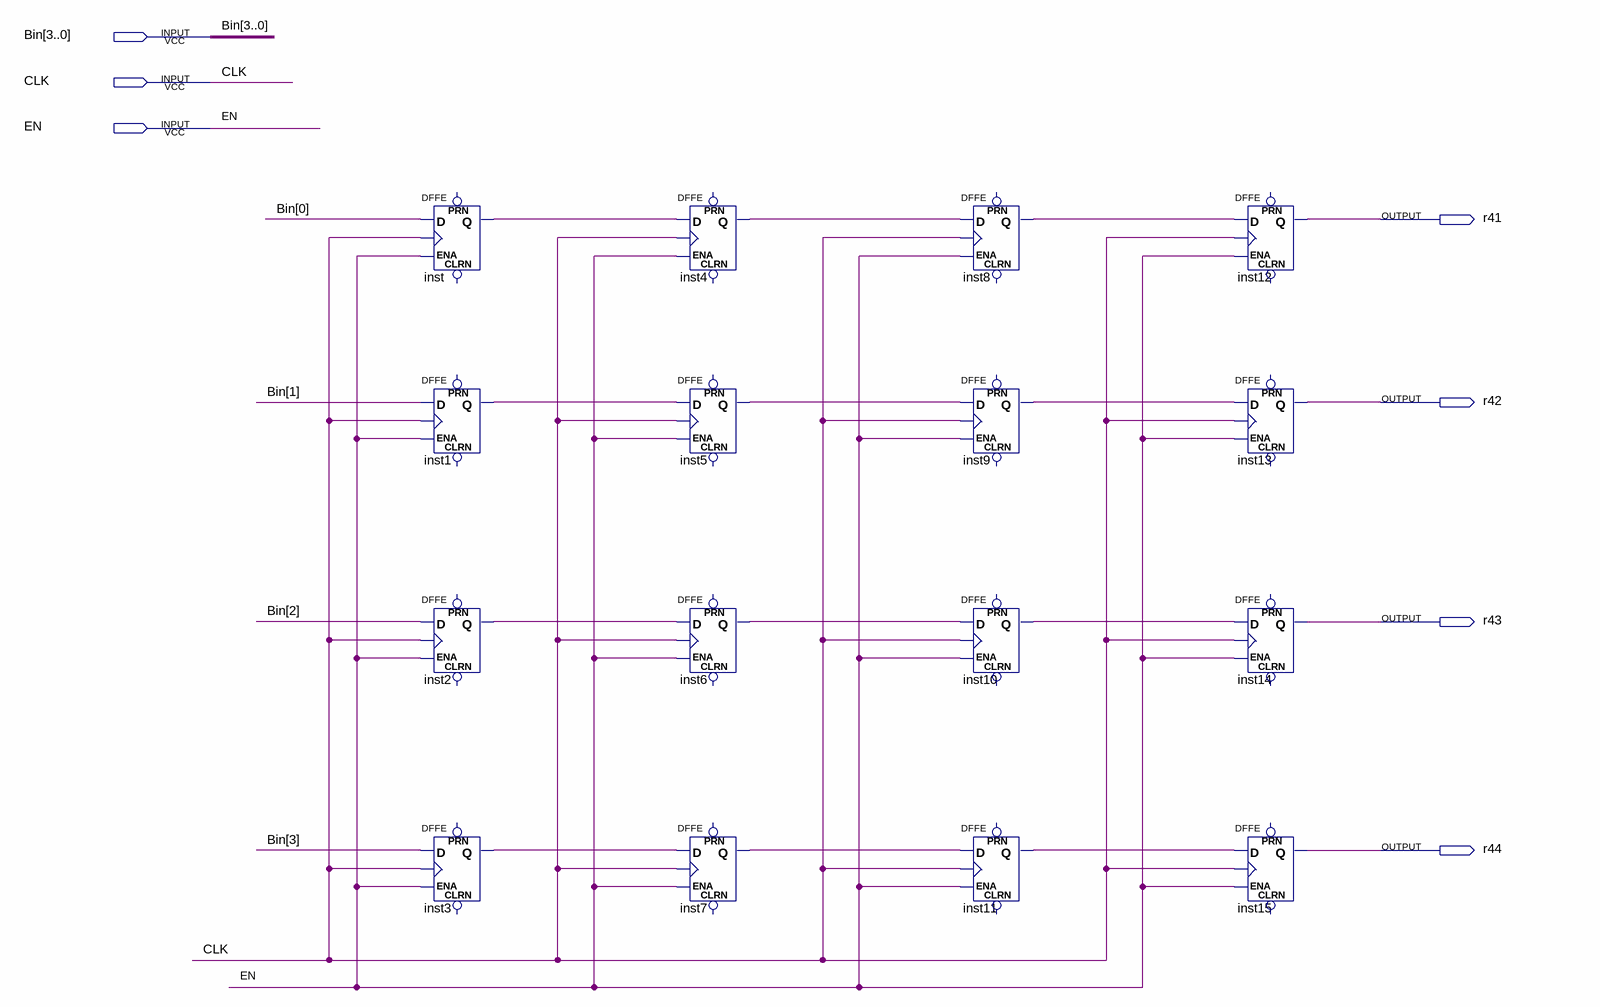
[diagram p0: schematic sheet]
// Quartus schematic bangoRegister.bdf as structural Verilog: 16 symbols, 7 pins
module bangoRegister (
  input  [3:0] Bin,
  input  CLK,
  input  EN,
  output r41,
  output r42,
  output r43,
  output r44
);

  wire inst1_q, inst2_q, inst3_q, inst4_q, inst5_q, inst6_q, inst7_q, inst8_q, inst9_q, inst10_q, inst11_q,
       inst_q;

  DFFE inst (.D(Bin[0]), .CLK(CLK), .ENA(EN), .Q(inst_q));  // open: PRN, CLRN
  DFFE inst1 (.D(Bin[1]), .CLK(CLK), .ENA(EN), .Q(inst1_q));  // open: PRN, CLRN
  DFFE inst2 (.D(Bin[2]), .CLK(CLK), .ENA(EN), .Q(inst2_q));  // open: PRN, CLRN
  DFFE inst3 (.D(Bin[3]), .CLK(CLK), .ENA(EN), .Q(inst3_q));  // open: PRN, CLRN
  DFFE inst4 (.D(inst_q), .CLK(CLK), .ENA(EN), .Q(inst4_q));  // open: PRN, CLRN
  DFFE inst5 (.D(inst1_q), .CLK(CLK), .ENA(EN), .Q(inst5_q));  // open: PRN, CLRN
  DFFE inst6 (.D(inst2_q), .CLK(CLK), .ENA(EN), .Q(inst6_q));  // open: PRN, CLRN
  DFFE inst7 (.D(inst3_q), .CLK(CLK), .ENA(EN), .Q(inst7_q));  // open: PRN, CLRN
  DFFE inst8 (.D(inst4_q), .CLK(CLK), .ENA(EN), .Q(inst8_q));  // open: PRN, CLRN
  DFFE inst9 (.D(inst5_q), .CLK(CLK), .ENA(EN), .Q(inst9_q));  // open: PRN, CLRN
  DFFE inst10 (.D(inst6_q), .CLK(CLK), .ENA(EN), .Q(inst10_q));  // open: PRN, CLRN
  DFFE inst11 (.D(inst7_q), .CLK(CLK), .ENA(EN), .Q(inst11_q));  // open: PRN, CLRN
  DFFE inst12 (.D(inst8_q), .CLK(CLK), .ENA(EN), .Q(r41));  // open: PRN, CLRN
  DFFE inst13 (.D(inst9_q), .CLK(CLK), .ENA(EN), .Q(r42));  // open: PRN, CLRN
  DFFE inst14 (.D(inst10_q), .CLK(CLK), .ENA(EN), .Q(r43));  // open: PRN, CLRN
  DFFE inst15 (.D(inst11_q), .CLK(CLK), .ENA(EN), .Q(r44));  // open: PRN, CLRN
endmodule
